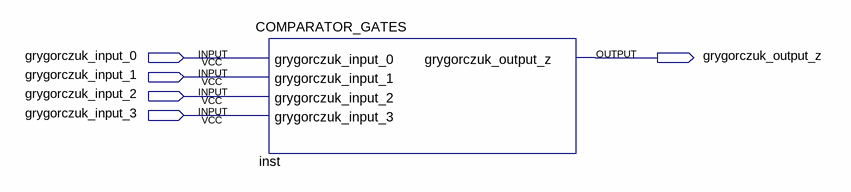
[diagram p0: schematic sheet]
// Quartus schematic COMPARATOR_SYMBOL.bdf as structural Verilog: 1 symbols, 5 pins
module COMPARATOR_SYMBOL (
  input  grygorczuk_input_0,
  input  grygorczuk_input_1,
  input  grygorczuk_input_2,
  input  grygorczuk_input_3,
  output grygorczuk_output_z
);

  COMPARATOR_GATES inst (
    .grygorczuk_input_0(grygorczuk_input_0), .grygorczuk_input_1(grygorczuk_input_1),
    .grygorczuk_input_2(grygorczuk_input_2), .grygorczuk_input_3(grygorczuk_input_3),
    .grygorczuk_output_z(grygorczuk_output_z));
endmodule
